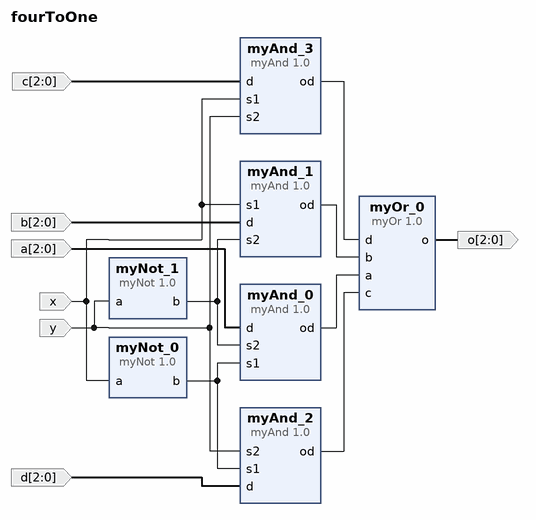
[diagram p0: block diagram of the top level]
# Vivado block design fourToOne, xc7a100tcsg324-1, Vivado 2018.3
create_bd_design fourToOne

create_bd_port -dir I x
create_bd_port -dir I y
create_bd_port -dir I -from 2 -to 0 a
create_bd_port -dir I -from 2 -to 0 b
create_bd_port -dir I -from 2 -to 0 c
create_bd_port -dir I -from 2 -to 0 d
create_bd_port -dir O -from 2 -to 0 o

create_bd_cell -type ip -vlnv xilinx.com:user:myOr:1.0 myOr_0
create_bd_cell -type ip -vlnv xilinx.com:user:myAnd:1.0 myAnd_0
create_bd_cell -type ip -vlnv xilinx.com:user:myNot:1.0 myNot_0
create_bd_cell -type ip -vlnv xilinx.com:user:myAnd:1.0 myAnd_1
create_bd_cell -type ip -vlnv xilinx.com:user:myAnd:1.0 myAnd_2
create_bd_cell -type ip -vlnv xilinx.com:user:myAnd:1.0 myAnd_3
create_bd_cell -type ip -vlnv xilinx.com:user:myNot:1.0 myNot_1

# ---- connections ----

connect_bd_net [get_bd_pins myOr_0/o] [get_bd_ports o]
connect_bd_net [get_bd_pins myAnd_0/od] [get_bd_pins myOr_0/a]
connect_bd_net [get_bd_pins myAnd_1/od] [get_bd_pins myOr_0/b]
connect_bd_net [get_bd_pins myAnd_2/od] [get_bd_pins myOr_0/c]
connect_bd_net [get_bd_pins myAnd_3/od] [get_bd_pins myOr_0/d]
connect_bd_net [get_bd_ports x] [get_bd_pins myNot_0/a] [get_bd_pins myAnd_1/s1] [get_bd_pins myAnd_3/s1]
connect_bd_net [get_bd_ports y] [get_bd_pins myNot_1/a] [get_bd_pins myAnd_2/s2] [get_bd_pins myAnd_3/s2]
connect_bd_net [get_bd_ports a] [get_bd_pins myAnd_0/d]
connect_bd_net [get_bd_ports b] [get_bd_pins myAnd_1/d]
connect_bd_net [get_bd_ports d] [get_bd_pins myAnd_2/d]
connect_bd_net [get_bd_ports c] [get_bd_pins myAnd_3/d]
connect_bd_net [get_bd_pins myNot_0/b] [get_bd_pins myAnd_0/s1] [get_bd_pins myAnd_2/s1]
connect_bd_net [get_bd_pins myNot_1/b] [get_bd_pins myAnd_0/s2] [get_bd_pins myAnd_1/s2]

validate_bd_design
save_bd_design
